# Altium schematic sheet MCU.SchDoc: MCU
size A4; Author: DODANHLUONG; Revision: 1.0; SheetNumber: 4; SheetTotal: 6; ProjectTitle: KIT ARDUINO VERSION 1.0
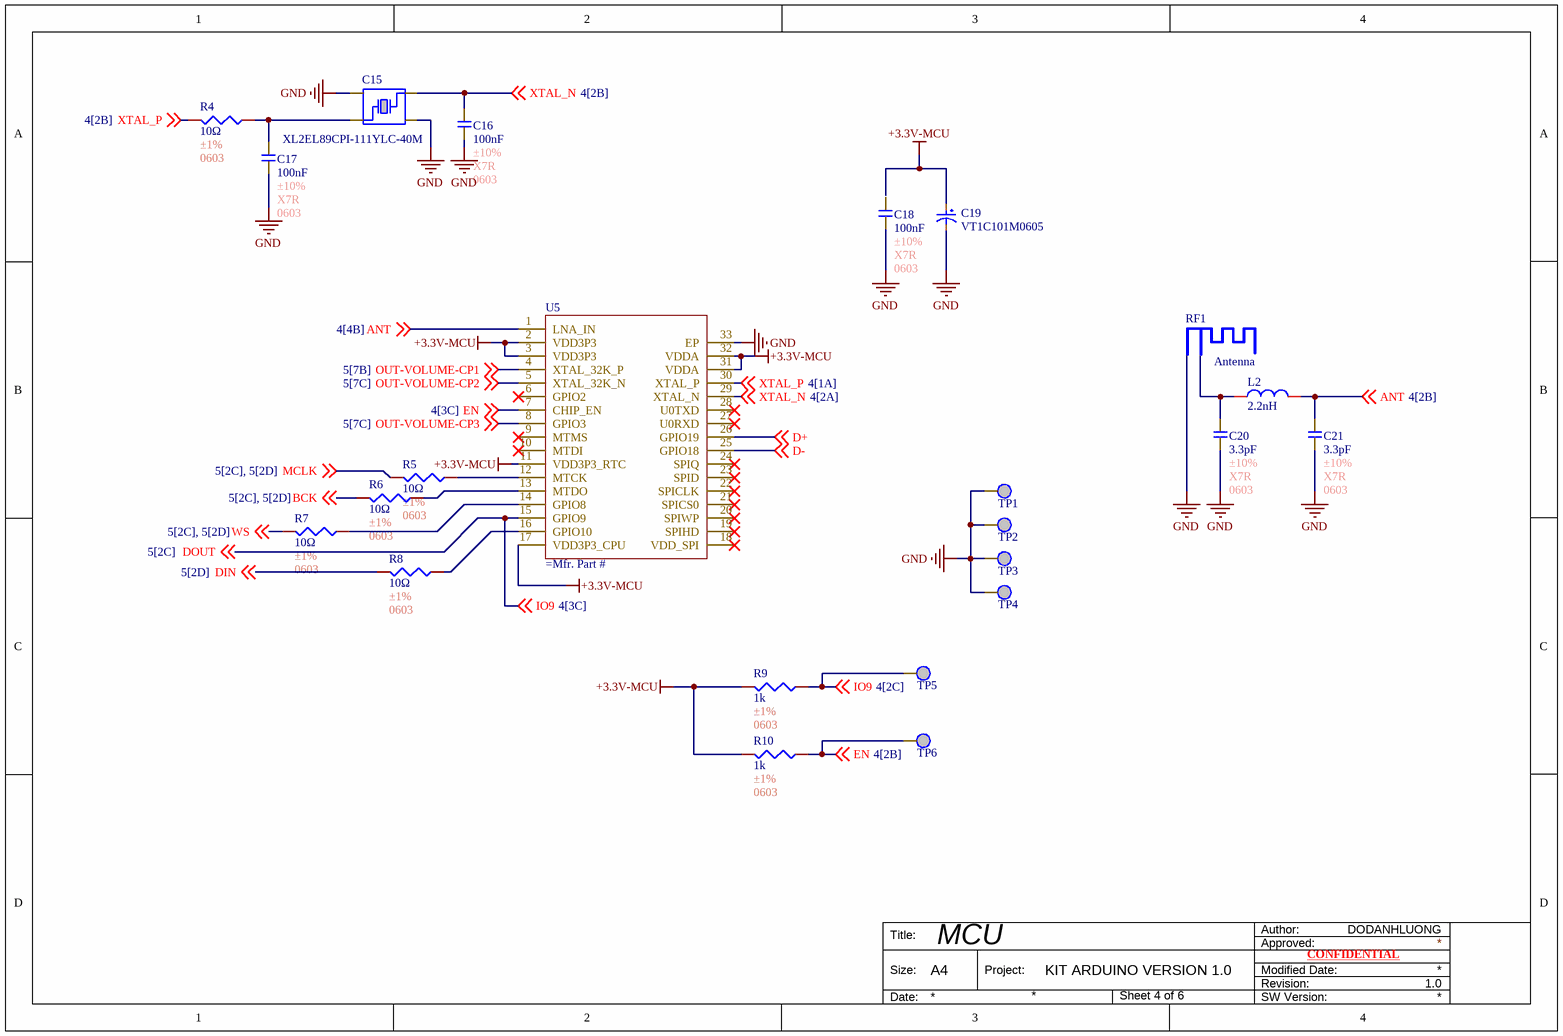
[diagram p0: MCU.SchDoc]

## Parts
C15  XL2EL89CPI-111YLC-40M  [XL2EL89CPI-111YLC-40M]
C16  100nF  Tolerance: ±10%  Temperature Coefficient: X7R  Package: 0603  [C0603]
C17  100nF  Tolerance: ±10%  Temperature Coefficient: X7R  Package: 0603  [C0603]
C18  100nF  Tolerance: ±10%  Temperature Coefficient: X7R  Package: 0603  [C0603]
C19  VT1C101M0605  [C_100uF_16V_Aluminum]
C20  3.3pF  Tolerance: ±10%  Temperature Coefficient: X7R  Package: 0603  [C0603]
C21  3.3pF  Tolerance: ±10%  Temperature Coefficient: X7R  Package: 0603  [C0603]
L2  2.2nH  [CD43]
R4  10Ω  Tolerance: ±1%  Package: 0603  [R0603]
R5  10Ω  Tolerance: ±1%  Package: 0603  [R0603]
R6  10Ω  Tolerance: ±1%  Package: 0603  [R0603]
R7  10Ω  Tolerance: ±1%  Package: 0603  [R0603]
R8  10Ω  Tolerance: ±1%  Package: 0603  [R0603]
R9  1k  Tolerance: ±1%  Package: 0603  [R0603]
R10  1k  Tolerance: ±1%  Package: 0603  [R0603]
RF1  Antenna  [2.4GHZ-50OHMS_v1.1]
TP1  TP  [TP]  (value not drawn)
TP2  TP  [TP]  (value not drawn)
TP3  TP  [TP]  (value not drawn)
TP4  TP  [TP]  (value not drawn)
TP5  TP  [TP]  (value not drawn)
TP6  TP  [TP]  (value not drawn)
U5  (no value)  [ESP32-C3]

## Nets
+3.3V-MCU: C19.1 R9.2 R10.2 U5.2(VDD3P3) U5.3(VDD3P3) U5.11(VDD3P3_RTC) U5.17(VDD3P3_CPU) U5.31(VDDA) U5.32(VDDA)
GND: C15.2 C15.4 C16.1 C17.1 C18.1 C19.2 C20.1 C21.1 RF1.2 TP1.1 TP2.1 TP3.1 TP4.1 U5.33(EP)
ANT: C21.2 L2.2 U5.1(LNA_IN) ; off-sheet ANT
BCK: R6.2 ; off-sheet BCK
D+: U5.26(GPIO19) ; off-sheet D+
D-: U5.25(GPIO18) ; off-sheet D-
DIN: R8.2 ; off-sheet DIN
DOUT: R9.1 TP5.1 U5.15(GPIO9) ; off-sheet DOUT, off-sheet IO9  [also labelled IO9]
EN: R10.1 TP6.1 U5.7(CHIP_EN) ; off-sheet EN
MCLK: R5.2 ; off-sheet MCLK
OUT-VOLUME-CP1: U5.4(XTAL_32K_P) ; off-sheet OUT-VOLUME-CP1
OUT-VOLUME-CP2: U5.5(XTAL_32K_N) ; off-sheet OUT-VOLUME-CP2
OUT-VOLUME-CP3: U5.8(GPIO3) ; off-sheet OUT-VOLUME-CP3
WS: R7.2 ; off-sheet WS
XTAL_N: C15.3 C16.2 U5.29(XTAL_N) ; off-sheet XTAL_N
XTAL_P: R4.2 U5.30(XTAL_P) ; off-sheet XTAL_P
NetC15_1: C15.1 C17.2 R4.1
NetC20_2: C20.2 L2.1 RF1.1
NetR5_1: R5.1 U5.12(MTCK)
NetR6_1: R6.1 U5.13(MTDO)
NetR7_1: R7.1 U5.14(GPIO8)
NetR8_1: R8.1 U5.16(GPIO10)

Not connected (* = marked no-connect by the designer): C18 2; U5 6(GPIO2)* 9(MTMS)* 10(MTDI)* 18(VDD_SPI)* 19(SPIHD)* 20(SPIWP)* 21(SPICS0)* 22(SPICLK)* 23(SPID)* 24(SPIQ)* 27(U0RXD)* 28(U0TXD)*

## Notes on the sheet
- Author:
- Title:
- Size:
- A4
- Project:
- Approved:
- Revision:
- Modified Date:
- CONFIDENTIAL
- Date:
- SW Version:

## Library data of the parts
C15 = XL2EL89CPI-111YLC-40M: Crystal Oscillator 15pF SMD3225-4P Crystals RoHS; Manufacturer: YXC Crystal Oscillators; Mfr. Part #: XL2EL89CPI-111YLC-40M; LCSC Part #: C5444549; Package: SMD3225-4P; Link: https://www.lcsc.com/product-detail/C5444549.html?s_z=n_oscillator; Key Attributes: Crystal Oscillator 15pF SMD3225-4P Crystals RoHS
C16-C18 C20 C21 = C0603_100nF_±10%_X7R: 50V 100nF X7R ±10% 0603 Multilayer Ceramic Capacitors MLCC - SMD/SMT ROHS; Manufacturer: YAGEO; Mfr. Part #: CC0603KRX7R9BB104; LCSC Part #: C14663; Capacitance: 100nF; Link: https://www.lcsc.com/product-detail/C14663.html?s_z=n_capital%25200603%2520100nf
C19 = C_100uF_16V_aluminum: 100uF 16V ±20% 63mA@120Hz SMD,D6.3xL5.4mm Aluminum Electrolytic Capacitors RoHS; Manufacturer: ROQANG; Key Attributes: CAP ALUM 100uF ±20% 16V SMD; Mfr. Part #: VT1C101M0605; LCSC Part #: C90273; Package: SMD,D6.3xL5.4mm; Link: https://www.lcsc.com/product-detail/C90273.html?s_z=n_capital%2520100uf%2520aluminum
L2 = CD4-10UH: 1.15A 10uH Unshielded Inductor ±20% SMD,4x4.5mm Power Inductors ROHS; Manufacturer: ZE; Mfr. Part #: CD43-100M; Key Attributes: FIXED IND 10uH 1.15A 182mΩ SMD,4x4.5mm; DC Resistance(DCR): 182mΩ; LCSC Part #: C18734467; Package: SMD,4x4.5mm; Link: https://www.lcsc.com/product-detail/C18734467.html?s_z=n_CD43%252010uH; Tolerance: ±20%; Current Rating: 1.15A; Inductance: 10uH
R4-R10 = R0603_10Ω_±1%: 62.5mW Thick Film Resistor 50V ±1% ±200ppm/℃ 10Ω 0402 Chip Resistor - Surface Mount ROHS; Manufacturer: YAGEO; Mfr. Part #: RC0402FR-0710RL; LCSC Part #: C138066; Resistance: 10Ω; Link: https://www.lcsc.com/product-detail/C138066.html?s_z=n_resistor%25200402%252010R
U5 = ESP32-C3: Others 160MHz QFN-32-EP(5x5) RF Transceiver Modules and Modems RoHS; Manufacturer: ESPRESSIF; LCSC Part #: C2838500; Package: QFN-32-EP(5x5); Link: https://www.lcsc.com/product-detail/C2838500.html?s_z=n_ESP32%2520C3